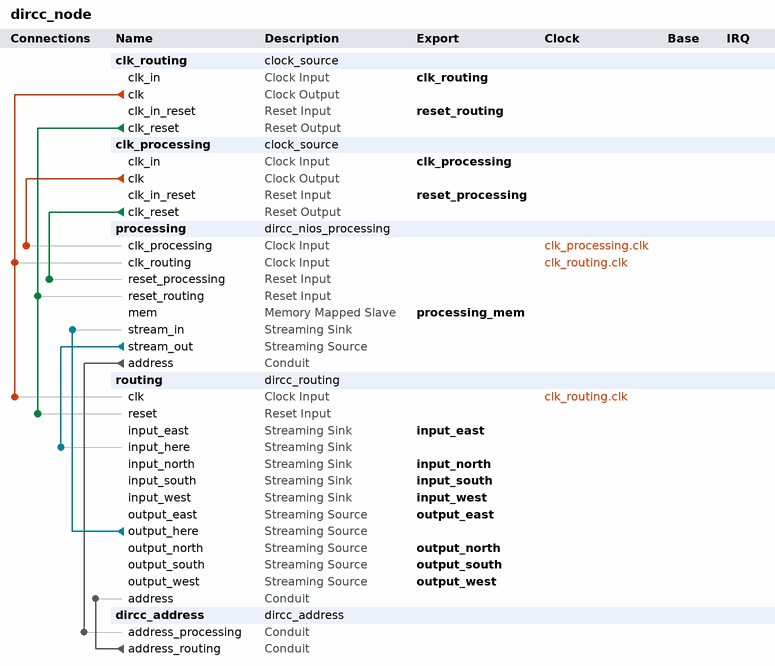
[diagram p0: system contents]
# Platform Designer (Qsys) system dircc_node, Cyclone V 5CSEMA5F31C6
# Parameters at their usual value, and those the tool derives, are not listed.
package require -exact qsys 16.1
create_system dircc_node
set_project_property DEVICE_FAMILY {Cyclone V}
set_project_property DEVICE 5CSEMA5F31C6

add_instance clk_routing clock_source 16.1
set_instance_parameter_value clk_routing clockFrequency 50000000
set_instance_parameter_value clk_routing resetSynchronousEdges DEASSERT

add_instance clk_processing clock_source 16.1
set_instance_parameter_value clk_processing clockFrequency 50000000
set_instance_parameter_value clk_processing resetSynchronousEdges DEASSERT

add_instance processing dircc_nios_processing 1.0

add_instance routing dircc_routing 1.0

add_instance dircc_address dircc_address 1.0
set_instance_parameter_value dircc_address ADDRESS 0

# connections
add_connection clk_processing.clk processing.clk_processing clock
add_connection clk_routing.clk processing.clk_routing clock
add_connection clk_routing.clk routing.clk clock
add_connection clk_processing.clk_reset processing.reset_processing reset
add_connection clk_routing.clk_reset processing.reset_routing reset
add_connection clk_routing.clk_reset routing.reset reset
add_connection processing.stream_out routing.input_here avalon_streaming
add_connection routing.output_here processing.stream_in avalon_streaming
add_connection dircc_address.address_routing routing.address conduit
add_connection processing.address dircc_address.address_processing conduit

# exported interfaces
add_interface clk_processing clock sink
set_interface_property clk_processing EXPORT_OF clk_processing.clk_in
add_interface clk_routing clock sink
set_interface_property clk_routing EXPORT_OF clk_routing.clk_in
add_interface input_east avalon_streaming sink
set_interface_property input_east EXPORT_OF routing.input_east
add_interface input_north avalon_streaming sink
set_interface_property input_north EXPORT_OF routing.input_north
add_interface input_south avalon_streaming sink
set_interface_property input_south EXPORT_OF routing.input_south
add_interface input_west avalon_streaming sink
set_interface_property input_west EXPORT_OF routing.input_west
add_interface output_east avalon_streaming source
set_interface_property output_east EXPORT_OF routing.output_east
add_interface output_north avalon_streaming source
set_interface_property output_north EXPORT_OF routing.output_north
add_interface output_south avalon_streaming source
set_interface_property output_south EXPORT_OF routing.output_south
add_interface output_west avalon_streaming source
set_interface_property output_west EXPORT_OF routing.output_west
add_interface processing_mem avalon slave
set_interface_property processing_mem EXPORT_OF processing.mem
add_interface reset_processing reset sink
set_interface_property reset_processing EXPORT_OF clk_processing.clk_in_reset
add_interface reset_routing reset sink
set_interface_property reset_routing EXPORT_OF clk_routing.clk_in_reset

set_interconnect_requirement {$system} qsys_mm.clockCrossingAdapter HANDSHAKE
set_interconnect_requirement {$system} qsys_mm.enableEccProtection FALSE
set_interconnect_requirement {$system} qsys_mm.insertDefaultSlave FALSE
set_interconnect_requirement {$system} qsys_mm.maxAdditionalLatency 1

save_system dircc_node.qsys
